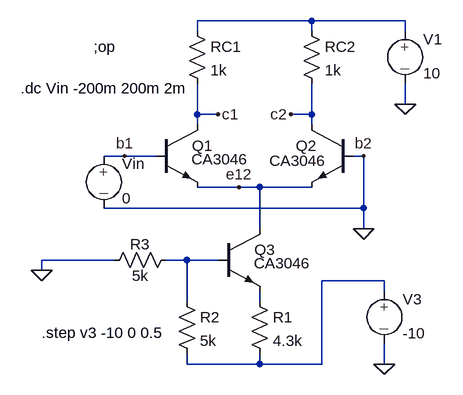
[diagram p0: schematic diff-reale-i-quelle.asc]
diff-reale-i-quelle.asc, the LTspice schematic file:
Version 4
SHEET 1 880 680
WIRE 368 -48 192 -48
WIRE 512 -48 368 -48
WIRE 192 -32 192 -48
WIRE 368 -32 368 -48
WIRE 512 -32 512 -48
WIRE 512 80 512 48
WIRE 192 96 192 48
WIRE 224 96 192 96
WIRE 368 96 368 48
WIRE 368 96 336 96
WIRE 192 112 192 96
WIRE 368 112 368 96
WIRE 80 160 48 160
WIRE 128 160 80 160
WIRE 448 160 432 160
WIRE 256 208 192 208
WIRE 288 208 256 208
WIRE 368 208 288 208
WIRE 448 240 448 160
WIRE 448 240 48 240
WIRE 288 272 288 208
WIRE 448 272 448 240
WIRE 64 320 -48 320
WIRE 176 320 144 320
WIRE 224 320 176 320
WIRE -48 336 -48 320
WIRE 480 352 384 352
WIRE 480 368 480 352
WIRE 176 384 176 320
WIRE 288 384 288 368
WIRE 176 480 176 464
WIRE 288 480 288 464
WIRE 288 480 176 480
WIRE 384 480 384 352
WIRE 384 480 288 480
WIRE 480 480 480 448
FLAG 512 80 0
FLAG 224 96 c1
FLAG 336 96 c2
FLAG 80 160 b1
FLAG 448 160 b2
FLAG 256 208 e12
FLAG 448 272 0
FLAG 480 480 0
FLAG -48 336 0
SYMBOL EIT_Semiconductors\\npn 128 112 R0
WINDOW 3 55 53 Left 2
SYMATTR Value CA3046
SYMATTR InstName Q1
SYMBOL EIT_Semiconductors\\npn 432 112 M0
WINDOW 3 42 55 Left 2
SYMATTR Value CA3046
SYMATTR InstName Q2
SYMBOL source-V 48 144 R0
SYMATTR InstName Vin
SYMATTR Value 0
SYMBOL res 176 -48 R0
SYMATTR InstName RC1
SYMATTR Value 1k
SYMBOL res 352 -48 R0
SYMATTR InstName RC2
SYMATTR Value 1k
SYMBOL source-V 512 -48 R0
SYMATTR InstName V1
SYMATTR Value 10
SYMBOL EIT_Semiconductors\\npn 224 272 R0
WINDOW 3 55 53 Left 2
SYMATTR Value CA3046
SYMATTR InstName Q3
SYMBOL res 272 368 R0
SYMATTR InstName R1
SYMATTR Value 4.3k
SYMBOL res 160 368 R0
SYMATTR InstName R2
SYMATTR Value 5k
SYMBOL res 160 304 R90
WINDOW 0 7 56 VBottom 2
WINDOW 3 25 56 VTop 2
SYMATTR InstName R3
SYMATTR Value 5k
SYMBOL source-V 480 352 R0
SYMATTR InstName V3
SYMATTR Value -10
TEXT 32 -8 Left 2 !;op
TEXT -80 56 Left 2 !.dc Vin -200m 200m 2m
TEXT -48 432 Left 2 !.step v3 -10 0 0.5

The netlist it stands for:
* diff-reale-i-quelle.asc
Q1 c1 b1 e12 0 CA3046
Q2 c2 0 e12 0 CA3046
Vin b1 0 0
RC1 N001 c1 1k
RC2 N001 c2 1k
V1 N001 0 10
Q3 e12 N002 N004 0 CA3046
R1 N004 N003 4.3k
R2 N002 N003 5k
R3 N002 0 5k
V3 N003 0 -10
.model NPN NPN
.model PNP PNP
.lib standard.bjt
;op
.dc Vin -200m 200m 2m
.step v3 -10 0 0.5
.backanno
.end